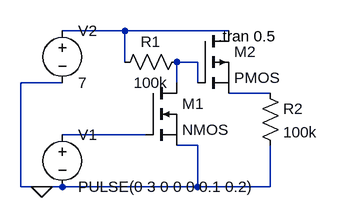
[diagram p0: schematic Draft51.asc]
Draft51.asc, the LTspice schematic file:
Version 4
SHEET 1 880 680
WIRE 240 176 144 176
WIRE 400 176 240 176
WIRE 240 224 240 176
WIRE 352 224 320 224
WIRE 144 256 80 256
WIRE 320 256 320 224
WIRE 352 256 352 224
WIRE 464 272 400 272
WIRE 272 336 144 336
WIRE 352 352 320 352
WIRE 80 416 80 256
WIRE 112 416 80 416
WIRE 144 416 112 416
WIRE 352 416 352 352
WIRE 352 416 144 416
WIRE 464 416 464 352
WIRE 464 416 352 416
FLAG 112 416 0
SYMBOL voltage 144 320 R0
SYMATTR InstName V1
SYMATTR Value PULSE(0 3 0 0 0 0.1 0.2)
SYMBOL voltage 144 160 R0
SYMATTR InstName V2
SYMATTR Value 7
SYMBOL nmos 272 256 R0
SYMATTR InstName M1
SYMBOL pmos 352 176 R0
SYMATTR InstName M2
SYMBOL res 336 208 R90
WINDOW 0 0 56 VBottom 2
WINDOW 3 32 56 VTop 2
SYMATTR InstName R1
SYMATTR Value 100k
SYMBOL res 448 256 R0
SYMATTR InstName R2
SYMATTR Value 100k
TEXT 384 184 Left 2 !.tran 0.5

The netlist it stands for:
* Draft51.asc
V1 N004 0 PULSE(0 3 0 0 0 0.1 0.2)
V2 N001 0 7
M1 N002 N004 0 0 NMOS
M2 N001 N002 N003 N003 PMOS
R1 N002 N001 100k
R2 N003 0 100k
.model NMOS NMOS
.model PMOS PMOS
.lib standard.mos
.tran 0.5
.backanno
.end